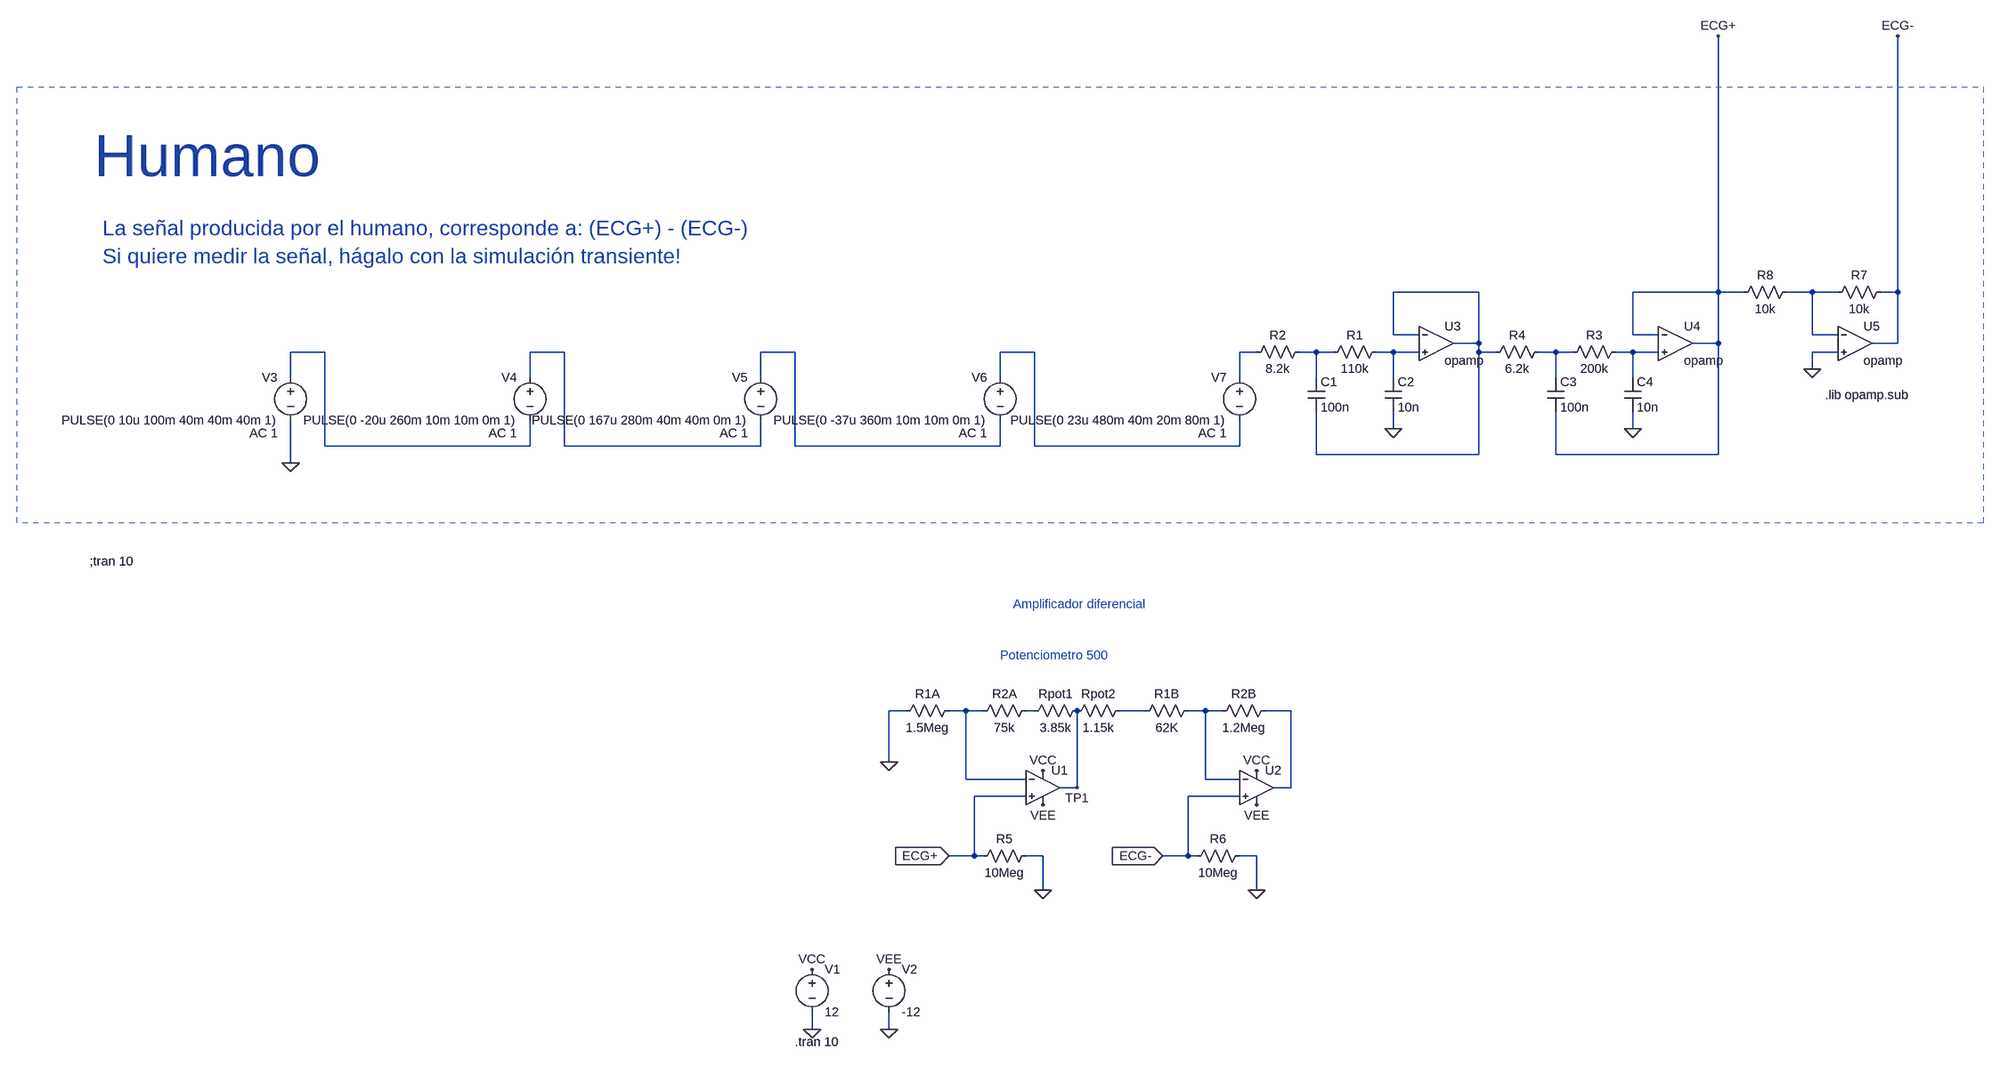
[diagram p0: schematic Amplificador diferencial.asc]
Amplificador diferencial.asc, the LTspice schematic file:
Version 4
SHEET 1 1892 680
WIRE 944 -880 784 -880
WIRE 1392 -880 1392 -1360
WIRE 1392 -880 1232 -880
WIRE 1440 -880 1392 -880
WIRE 1568 -880 1520 -880
WIRE 1616 -880 1568 -880
WIRE 1728 -880 1728 -1360
WIRE 1728 -880 1696 -880
WIRE 784 -800 784 -880
WIRE 832 -800 784 -800
WIRE 1232 -800 1232 -880
WIRE 1280 -800 1232 -800
WIRE 1568 -800 1568 -880
WIRE 1616 -800 1568 -800
WIRE 944 -784 944 -880
WIRE 944 -784 896 -784
WIRE 1392 -784 1392 -880
WIRE 1392 -784 1344 -784
WIRE 1728 -784 1728 -880
WIRE 1728 -784 1680 -784
WIRE -1216 -768 -1280 -768
WIRE -768 -768 -832 -768
WIRE -336 -768 -400 -768
WIRE 112 -768 48 -768
WIRE 528 -768 496 -768
WIRE 640 -768 608 -768
WIRE 672 -768 640 -768
WIRE 784 -768 752 -768
WIRE 832 -768 784 -768
WIRE 944 -768 944 -784
WIRE 976 -768 944 -768
WIRE 1088 -768 1056 -768
WIRE 1120 -768 1088 -768
WIRE 1232 -768 1200 -768
WIRE 1280 -768 1232 -768
WIRE 1616 -768 1568 -768
WIRE 1568 -736 1568 -768
WIRE -1280 -720 -1280 -768
WIRE -832 -720 -832 -768
WIRE -400 -720 -400 -768
WIRE 48 -720 48 -768
WIRE 496 -720 496 -768
WIRE 640 -720 640 -768
WIRE 784 -720 784 -768
WIRE 1088 -720 1088 -768
WIRE 1232 -720 1232 -768
WIRE 784 -624 784 -656
WIRE 1232 -624 1232 -656
WIRE -1216 -592 -1216 -768
WIRE -832 -592 -832 -640
WIRE -832 -592 -1216 -592
WIRE -768 -592 -768 -768
WIRE -400 -592 -400 -640
WIRE -400 -592 -768 -592
WIRE -336 -592 -336 -768
WIRE 48 -592 48 -640
WIRE 48 -592 -336 -592
WIRE 112 -592 112 -768
WIRE 496 -592 496 -640
WIRE 496 -592 112 -592
WIRE 640 -576 640 -656
WIRE 944 -576 944 -768
WIRE 944 -576 640 -576
WIRE 1088 -576 1088 -656
WIRE 1392 -576 1392 -784
WIRE 1392 -576 1088 -576
WIRE -1280 -560 -1280 -640
WIRE -128 -96 -160 -96
WIRE -16 -96 -48 -96
WIRE 16 -96 -16 -96
WIRE 112 -96 96 -96
WIRE 320 -96 272 -96
WIRE 432 -96 400 -96
WIRE 464 -96 432 -96
WIRE 592 -96 544 -96
WIRE -160 0 -160 -96
WIRE -16 32 -16 -96
WIRE 96 32 -16 32
WIRE 432 32 432 -96
WIRE 496 32 432 32
WIRE 192 48 192 -96
WIRE 192 48 160 48
WIRE 592 48 592 -96
WIRE 592 48 560 48
WIRE 96 64 0 64
WIRE 496 64 400 64
WIRE 0 176 0 64
WIRE 0 176 -48 176
WIRE 16 176 0 176
WIRE 128 176 96 176
WIRE 400 176 400 64
WIRE 400 176 352 176
WIRE 416 176 400 176
WIRE 528 176 496 176
WIRE 128 240 128 176
WIRE 528 240 528 176
WIRE -304 592 -304 560
WIRE -160 592 -160 560
FLAG 128 240 0
FLAG -160 0 0
FLAG 192 48 TP1
FLAG 128 16 VCC
FLAG 128 80 VEE
FLAG -304 592 0
FLAG -160 592 0
FLAG -304 480 VCC
FLAG -160 480 VEE
FLAG 528 240 0
FLAG -48 176 ECG+
IOPIN -48 176 In
FLAG 528 80 VEE
FLAG 528 16 VCC
FLAG -1280 -560 0
FLAG 784 -624 0
FLAG 1232 -624 0
FLAG 1568 -736 0
FLAG 1392 -1360 ECG+
FLAG 1728 -1360 ECG-
FLAG 352 176 ECG-
IOPIN 352 176 In
SYMBOL OpAmps\\UniversalOpAmp 128 48 R0
SYMATTR InstName U1
SYMBOL res -32 -112 R90
WINDOW 0 0 56 VBottom 2
WINDOW 3 32 56 VTop 2
SYMATTR InstName R1A
SYMATTR Value 1.5Meg
SYMBOL res 112 -112 R90
WINDOW 0 0 56 VBottom 2
WINDOW 3 32 56 VTop 2
SYMATTR InstName R2A
SYMATTR Value 75k
SYMBOL res 112 160 R90
WINDOW 0 0 56 VBottom 2
WINDOW 3 32 56 VTop 2
SYMATTR InstName R5
SYMATTR Value 10Meg
SYMBOL voltage -304 464 R0
WINDOW 123 0 0 Left 0
WINDOW 39 0 0 Left 0
SYMATTR InstName V1
SYMATTR Value 12
SYMBOL voltage -160 464 R0
WINDOW 123 0 0 Left 0
WINDOW 39 0 0 Left 0
SYMATTR InstName V2
SYMATTR Value -12
SYMBOL res 208 -112 R90
WINDOW 0 0 56 VBottom 2
WINDOW 3 32 56 VTop 2
SYMATTR InstName Rpot1
SYMATTR Value 3.85k
SYMBOL res 288 -112 R90
WINDOW 0 0 56 VBottom 2
WINDOW 3 32 56 VTop 2
SYMATTR InstName Rpot2
SYMATTR Value 1.15k
SYMBOL res 416 -112 R90
WINDOW 0 0 56 VBottom 2
WINDOW 3 32 56 VTop 2
SYMATTR InstName R1B
SYMATTR Value 62K
SYMBOL res 560 -112 R90
WINDOW 0 0 56 VBottom 2
WINDOW 3 32 56 VTop 2
SYMATTR InstName R2B
SYMATTR Value 1.2Meg
SYMBOL OpAmps\\UniversalOpAmp 528 48 R0
SYMATTR InstName U2
SYMBOL res 512 160 R90
WINDOW 0 0 56 VBottom 2
WINDOW 3 32 56 VTop 2
SYMATTR InstName R6
SYMATTR Value 10Meg
SYMBOL voltage -1280 -736 M0
WINDOW 123 24 120 Left 2
WINDOW 39 0 0 Left 0
SYMATTR Value2 AC 1
SYMATTR InstName V3
SYMATTR Value PULSE(0 10u 100m 40m 40m 40m 1)
SYMBOL voltage -832 -736 M0
WINDOW 123 24 120 Left 2
WINDOW 39 0 0 Left 0
SYMATTR Value2 AC 1
SYMATTR InstName V4
SYMATTR Value PULSE(0 -20u 260m 10m 10m 0m 1)
SYMBOL voltage -400 -736 M0
WINDOW 123 24 120 Left 2
WINDOW 39 0 0 Left 0
SYMATTR Value2 AC 1
SYMATTR InstName V5
SYMATTR Value PULSE(0 167u 280m 40m 40m 0m 1)
SYMBOL voltage 48 -736 M0
WINDOW 123 24 120 Left 2
WINDOW 39 0 0 Left 0
SYMATTR Value2 AC 1
SYMATTR InstName V6
SYMATTR Value PULSE(0 -37u 360m 10m 10m 0m 1)
SYMBOL voltage 496 -736 M0
WINDOW 123 24 120 Left 2
WINDOW 39 0 0 Left 0
SYMATTR Value2 AC 1
SYMATTR InstName V7
SYMATTR Value PULSE(0 23u 480m 40m 20m 80m 1)
SYMBOL cap 624 -720 R0
SYMATTR InstName C1
SYMATTR Value 100n
SYMBOL cap 768 -720 R0
SYMATTR InstName C2
SYMATTR Value 10n
SYMBOL res 768 -784 R90
WINDOW 0 0 56 VBottom 2
WINDOW 3 32 56 VTop 2
SYMATTR InstName R1
SYMATTR Value 110k
SYMBOL res 624 -784 R90
WINDOW 0 0 56 VBottom 2
WINDOW 3 32 56 VTop 2
SYMATTR InstName R2
SYMATTR Value 8.2k
SYMBOL cap 1072 -720 R0
SYMATTR InstName C3
SYMATTR Value 100n
SYMBOL cap 1216 -720 R0
SYMATTR InstName C4
SYMATTR Value 10n
SYMBOL res 1216 -784 R90
WINDOW 0 0 56 VBottom 2
WINDOW 3 32 56 VTop 2
SYMATTR InstName R3
SYMATTR Value 200k
SYMBOL res 1072 -784 R90
WINDOW 0 0 56 VBottom 2
WINDOW 3 32 56 VTop 2
SYMATTR InstName R4
SYMATTR Value 6.2k
SYMBOL Opamps\\opamp 864 -848 R0
SYMATTR InstName U3
SYMBOL Opamps\\opamp 1312 -848 R0
SYMATTR InstName U4
SYMBOL Opamps\\opamp 1648 -848 R0
SYMATTR InstName U5
SYMBOL res 1712 -896 R90
WINDOW 0 0 56 VBottom 2
WINDOW 3 32 56 VTop 2
SYMATTR InstName R7
SYMATTR Value 10k
SYMBOL res 1536 -896 R90
WINDOW 0 0 56 VBottom 2
WINDOW 3 32 56 VTop 2
SYMATTR InstName R8
SYMATTR Value 10k
TEXT 72 -296 Left 2 ;Amplificador diferencial
TEXT -336 616 Left 2 !.tran 10
TEXT -1656 -376 Left 2 !;tran 10
TEXT 1592 -688 Left 2 !.lib opamp.sub
TEXT -1648 -1136 Left 7 ;Humano
TEXT -1632 -1000 Left 4 ;La señal producida por el humano, corresponde a: (ECG+) - (ECG-)\nSi quiere medir la señal, hágalo con la simulación transiente!
TEXT 48 -200 Left 2 ;Potenciometro 500
RECTANGLE Normal 1888 -448 -1792 -1264 2

The netlist it stands for:
* Amplificador diferencial.asc
XU1 ECG+ N012 VCC VEE TP1 level1 Avol=1Meg GBW=10Meg Vos=0 En=0 Enk=0 In=0 Ink=0 Rin=500Meg  ; pins In+ In- V+ V- OUT
R1A N012 0 1.5Meg
R2A N013 N012 75k
R5 0 ECG+ 10Meg
V1 VCC 0 12
V2 VEE 0 -12
Rpot1 TP1 N013 3.85k
Rpot2 N014 TP1 1.15k
R1B N015 N014 62K
R2B N016 N015 1.2Meg
XU2 ECG- N015 VCC VEE N016 level1 Avol=1Meg GBW=10Meg Vos=0 En=0 Enk=0 In=0 Ink=0 Rin=500Meg  ; pins In+ In- V+ V- OUT
R6 0 ECG- 10Meg
V3 N003 0 PULSE(0 10u 100m 40m 40m 40m 1) AC 1
V4 N004 N003 PULSE(0 -20u 260m 10m 10m 0m 1) AC 1
V5 N005 N004 PULSE(0 167u 280m 40m 40m 0m 1) AC 1
V6 N006 N005 PULSE(0 -37u 360m 10m 10m 0m 1) AC 1
V7 N007 N006 PULSE(0 23u 480m 40m 20m 80m 1) AC 1
C1 N008 N001 100n
C2 N009 0 10n
R1 N009 N008 110k
R2 N008 N007 8.2k
C3 N010 ECG+ 100n
C4 N011 0 10n
R3 N011 N010 200k
R4 N010 N001 6.2k
XU3 N001 N009 N001 opamp Aol=100K GBW=10Meg  ; pins invin noninvin out
XU4 ECG+ N011 ECG+ opamp Aol=100K GBW=10Meg  ; pins invin noninvin out
XU5 N002 0 ECG- opamp Aol=100K GBW=10Meg  ; pins invin noninvin out
R7 ECG- N002 10k
R8 N002 ECG+ 10k
* Amplificador diferencial
.tran 10
;tran 10
.lib opamp.sub
* Humano
* La señal producida por el humano, corresponde a: (ECG+) - (ECG-)
* Si quiere medir la señal, hágalo con la simulación transiente!
* Potenciometro 500
.lib UniversalOpAmp1.lib
.backanno
.end